# Altium schematic sheet Actuator.SchDoc
size A; SheetNumber: 1; SheetTotal: 3
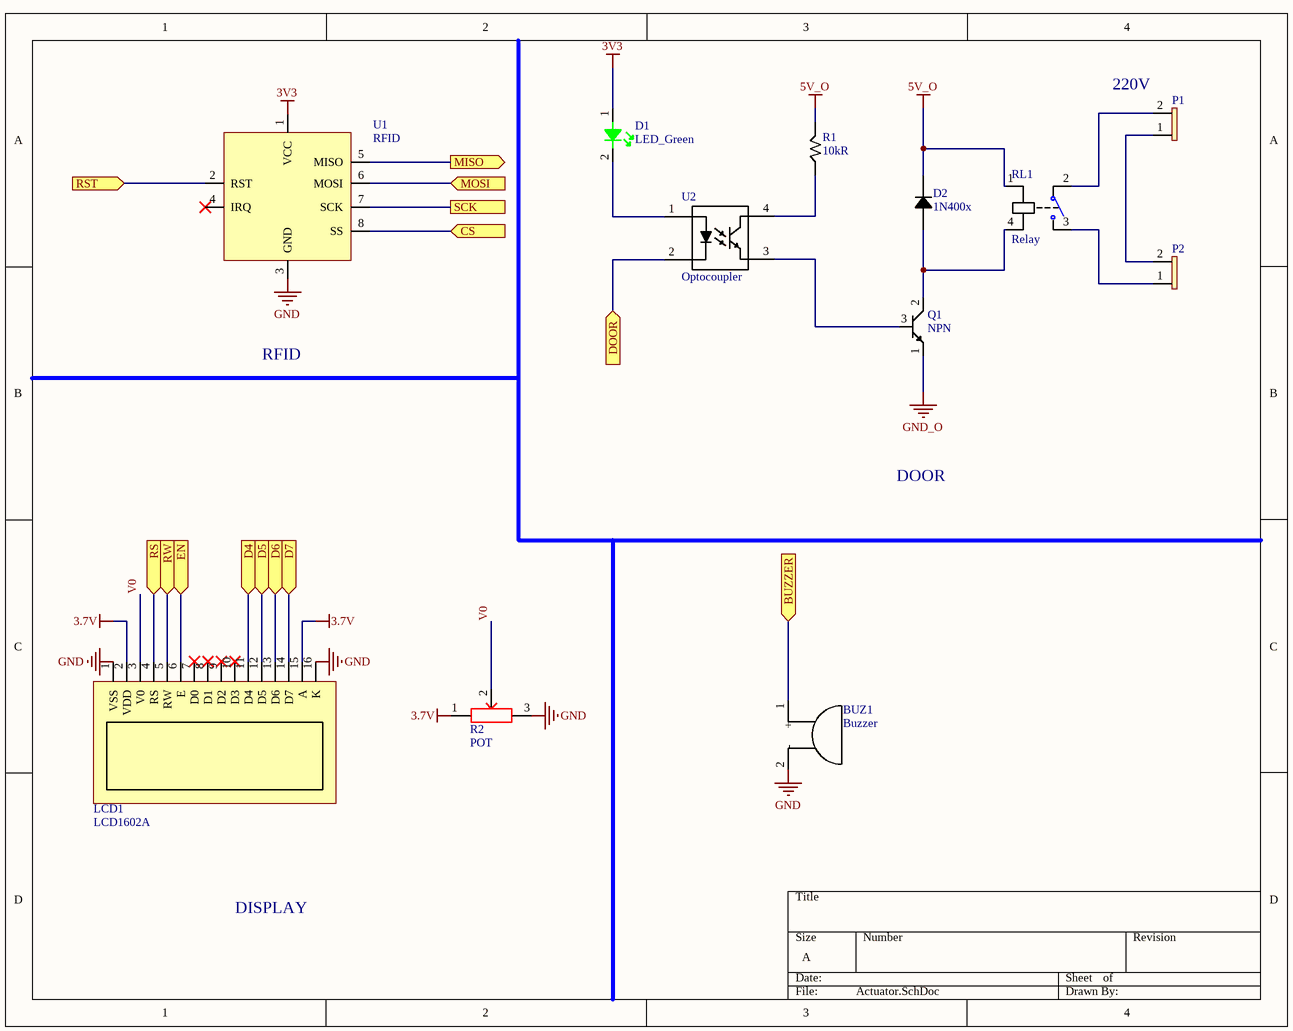
[diagram p0: Actuator.SchDoc]

## Parts
BUZ1  Buzzer  [Buzzer_7.6]
D1  LED_Green  [LED SMD 0805]
D2  1N400x  [1N4007-M7]
LCD1  LCD1602A  [LCD1602A]
P1  Header 1*2 Pins  [HDR_M_2_PINS_2.54]  (value not drawn)
P2  Header 1*2 Pins  [HDR_M_2_PINS_2.54]  (value not drawn)
Q1  NPN  [to-92]
R1  10kR  [RESC0805]
R2  POT  [WH148-3P]
RL1  Relay  [Relay G5NB]
U1  RFID  [RFID RC 522 Module]
U2  Optocoupler  [DIP 4]

## Ports
BUZZER (in), CS (in), D4 (in), D5 (in), D6 (in), D7 (in), DOOR (in), EN (in), MISO (out), MOSI (in), RS (in), RST (in), RW (in), SCK

## Nets
3.7V: LCD1.2(VDD) LCD1.15(A) R2.1
3V3: D1.1 U1.1(VCC)
5V_O: D2.2 R1.2 RL1.1
GND: BUZ1.2(-) LCD1.1(VSS) LCD1.16(K) R2.3 U1.3(GND)
GND_O: Q1.1(Emitter)
BUZZER: BUZ1.1(+) ; port BUZZER
CS: U1.8(SS) ; port CS
D4: LCD1.11(D4) ; port D4
D5: LCD1.12(D5) ; port D5
D6: LCD1.13(D6) ; port D6
D7: LCD1.14(D7) ; port D7
DOOR: U2.2(Cathode) ; port DOOR
EN: LCD1.6(E) ; port EN
MISO: U1.5(MISO) ; port MISO
MOSI: U1.6(MOSI) ; port MOSI
RS: LCD1.4(RS) ; port RS
RST: U1.2(RST) ; port RST
RW: LCD1.5(RW) ; port RW
SCK: U1.7(SCK) ; port SCK
V0: LCD1.3(V0) R2.2
NetD1_2: D1.2 U2.1(Anode)
NetD2_1: D2.1 Q1.2(Collector) RL1.4
NetP1_1: P1.1 P2.2
NetP1_2: P1.2 RL1.2
NetP2_1: P2.1 RL1.3
NetQ1_3: Q1.3(Base) U2.3(Emitter)
NetR1_1: R1.1 U2.4(Collector)

Not connected (* = marked no-connect by the designer): LCD1 7(D0)* 8(D1)* 9(D2)* 10(D3)*; U1 4(IRQ)*

## Notes on the sheet
- (near P1) 220V
- RFID
- DOOR
- DISPLAY

## Library data of the parts
D2 = Diode 1N4007: 1A - 1kV
P1 P2 = Header 1x2 Pins
Q1 = 2SC1815: Transistor NPN
R1 = Resistor: Resistor_TH_1/4W
R2 = POT_3Pins
RL1 = Relay G5NB: 4 Pins
U1 = RFID RC522 Module
U2 = Optocoupler: Opto